# EAGLE schematic arduino_uno_to_attiny_x5 (EAGLE 9.1.3)
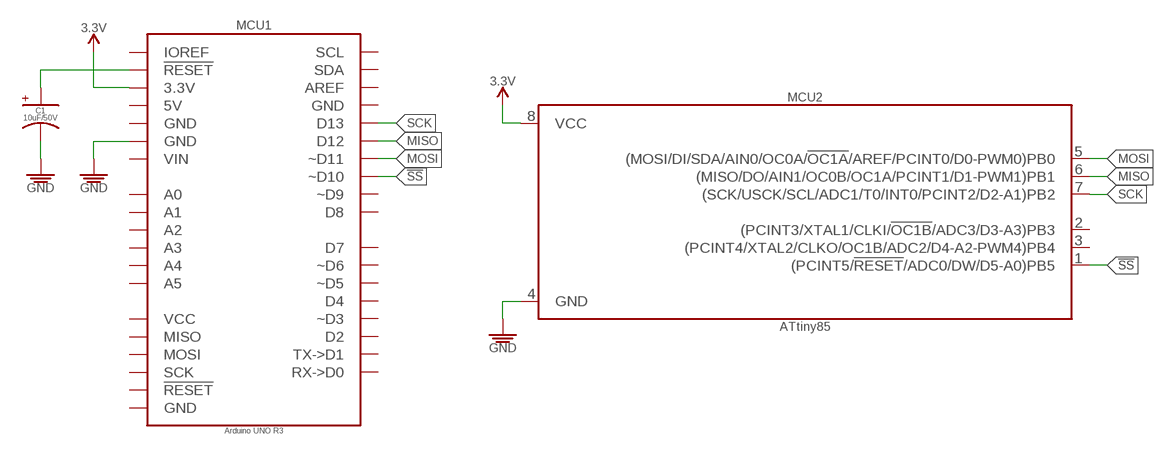
[diagram p0: schematic, sheet 1]

## Parts
C1  10uF/50V  10UF-POLARIZED_PTH_50V-20%  [_AE_PTH-DIA5-LS2-H5]
MCU1  Arduino UNO R3  ARDUINO_UNO_R3  [ARDUINO_UNO_R3]
MCU2  ATtiny85  ATTINY-X5_DIP-8_ATTINY-85  [DIP787W45P254L958H533Q8B_DIP-8_ATTINY-X5]

## Nets
3.3V: MCU1.3.3V MCU2.8(VCC)
!SS: MCU1.D10(~D10) MCU2.1((PCINT5/!RESET!/ADC0/DW/D5-A0)PB5)
GND: C1.-(K) MCU1.GND@3(GND) MCU2.4(GND)
MISO: MCU1.D12 MCU2.6((MISO/DO/AIN1/OC0B/OC1A/PCINT1/D1-PWM1)PB1)
MOSI: MCU1.D11(~D11) MCU2.5((MOSI/DI/SDA/AIN0/OC0A/!OC1A!/AREF/PCINT0/D0-PWM0)PB0)
N$1: C1.+(A) MCU1.RESET@1(!RESET!)
SCK: MCU1.D13 MCU2.7((SCK/USCK/SCL/ADC1/T0/INT0/PCINT2/D2-A1)PB2)
Unconnected: MCU1.5V MCU1.A0 MCU1.A1 MCU1.A2 MCU1.A3 MCU1.A4 MCU1.A5 MCU1.AREF MCU1.D0(RX->D0) MCU1.D1(TX->D1) MCU1.D2 MCU1.D3(~D3) MCU1.D4 MCU1.D5(~D5) MCU1.D6(~D6) MCU1.D7 MCU1.D8 MCU1.D9(~D9) MCU1.GND@1(GND) MCU1.GND@2(GND) MCU1.GND@4(GND) MCU1.IOREF MCU1.MISO MCU1.MOSI MCU1.RESET@2(!RESET!) MCU1.SCK MCU1.SCL MCU1.SDA MCU1.VCC MCU1.VIN MCU2.2((PCINT3/XTAL1/CLKI/!OC1B!/ADC3/D3-A3)PB3) MCU2.3((PCINT4/XTAL2/CLKO/OC1B/ADC2/D4-A2-PWM4)PB4)

## Library data of the parts
C1 = PiB_capacitors:10UF-POLARIZED; DATASHEET: https://industrial.panasonic.com/cdbs/www-data/pdf/RDF0000/ABA0000C1050.pdf; DIST: Digikey; DISTLINK: https://www.digikey.com/products/en/capacitors/aluminum-electrolytic-capacitors/58?k=P828-ND; DISTPN: P828-ND; MFR: Panasonic Electronic Components; MPN: ECE-A1HKA100
MCU1 = PiB_boards:ARDUINO_UNO_R3; DATASHEET: https://media.digikey.com/pdf/Data%20Sheets/Arduino%20PDFs/A000066_Web.pdf; DATASHEET_CABLE: http://www.assmann-wsw.com/fileadmin/datasheets/ASS_7066_CA.pdf; DIST: Digikey; DISTLINK: https://www.digikey.com/products/en?keywords=1050-1024-ND; DISTLINK_CABLE: https://www.digikey.com/products/en?keywords=AE1462-ND; DISTPN: 1050-1024-ND; DISTPN_CABLE: AE1462-ND; DIST_CABLE: Digikey; MFR: Arduino; MFR_CABLE: Assmann WSW Components; MPN: A000066; MPN_CABLE: AK672/2-1
MCU2 = PiB_ic_microcontrollers:ATTINY-X5; DATASHEET: http://www.microchip.com/mymicrochip/filehandler.aspx?ddocname=en589893; DIST: Digikey; DISTLINK: https://www.digikey.com/products/en?keywords=ATTINY85-20PU-ND; DISTPN: ATTINY85-20PU-ND; MFR: Microchip Technology; MPN: ATTINY85-20PU; SPICEPREFIX: X